# Altium schematic sheet S7CAS-PLEIADES-CARTE-MERE_P20_Title.SchDoc
size Tabloid; DocumentNumber: 1; SheetNumber: 1; SheetTotal: 19; Sheet_Name: Insert name in Document Parameters; Size: 11x17
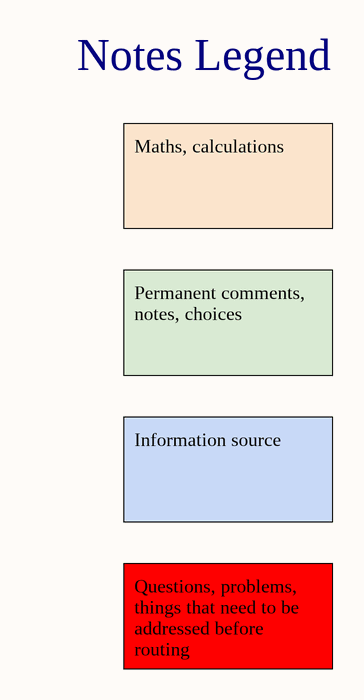
[diagram p0: S7CAS-PLEIADES-CARTE-MERE_P20_Title.SchDoc]

## Notes on the sheet
- Notes Legend
- Maths, calculations
- Permanent comments, notes, choices
- Information source
- Questions, problems, things that need to be addressed before routing
- Revision history
- Package size conversion
- Metric
- 1005
- 1608
- Imperial
- 0402
- 0603
- Revision
- 2012
- 3216
- 0805
- 1206
- 3225
- 6432
- 1210
- 2512
- Date :
- Project Title
- Global Project
- Size
- Group
- Date
- Sheet
- of
- Filename
- Designers